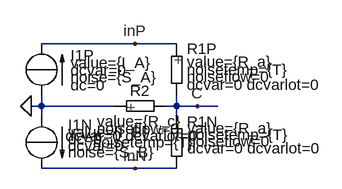
[diagram p0: schematic Tcircuit1.asc]
Tcircuit1.asc, the LTspice schematic file:
Version 4
SHEET 1 880 680
WIRE 96 64 -48 64
WIRE 160 64 96 64
WIRE -48 160 -48 144
WIRE -48 160 -64 160
WIRE 64 160 -48 160
WIRE 160 160 160 144
WIRE 160 160 144 160
WIRE 192 160 160 160
WIRE 224 160 192 160
WIRE -48 176 -48 160
WIRE 160 176 160 160
WIRE 96 256 -48 256
WIRE 160 256 96 256
FLAG -64 160 0
FLAG 96 64 inP
FLAG 96 256 inN
FLAG 192 160 C
SYMBOL SLR 160 64 R0
WINDOW 3 16 28 Left 2
WINDOW 39 16 51 Left 2
WINDOW 40 16 63 Left 2
SYMATTR Value value={R_a}
SYMATTR InstName R1P
SYMATTR Value2 noisetemp={T}
SYMBOL SLR 160 176 R0
WINDOW 3 17 18 Left 2
WINDOW 123 17 28 Left 2
WINDOW 39 17 38 Left 2
WINDOW 40 17 49 Left 2
SYMATTR Value value={R_a}
SYMATTR Value2 noisetemp={T}
SYMATTR InstName R1N
SYMBOL SLI -48 176 R0
WINDOW 0 41 13 Left 2
WINDOW 123 41 35 Left 2
WINDOW 39 41 45 Left 2
WINDOW 40 41 55 Left 2
SYMATTR InstName I1N
SYMATTR SpiceLine2 noise={S_B}
SYMATTR Value value={I_B}
SYMBOL SLI -48 144 M180
WINDOW 0 45 62 Left 2
WINDOW 3 45 51 Left 2
WINDOW 123 45 16 Left 2
WINDOW 39 45 39 Left 2
WINDOW 40 45 28 Left 2
SYMATTR InstName I1P
SYMATTR Value value={I_A}
SYMATTR SpiceLine2 noise={S_A}
SYMBOL SLR 64 160 M90
WINDOW 0 -8 40 VBottom 2
WINDOW 3 8 39 VTop 2
WINDOW 123 40 46 VTop 2
WINDOW 39 19 38 VTop 2
WINDOW 40 30 28 VTop 2
SYMATTR InstName R2
SYMATTR Value value={R_c}
SYMATTR Value2 noisetemp={T}

The netlist it stands for:
* Tcircuit1.asc
R1P inP C R value={R_a} noisetemp={T} noiseflow=0 dcvar=0 dcvarlot=0
R1N C inN R value={R_a} noisetemp={T} noiseflow=0 dcvar=0 dcvarlot=0
I1N 0 inN I value={I_B} dc=0 dcvar=0 noise={S_B}
I1P 0 inP I value={I_A} dc=0 dcvar=0 noise={S_A}
R2 0 C R value={R_c} noisetemp={T} noiseflow=0 dcvar=0 dcvarlot=0
.backanno
.end